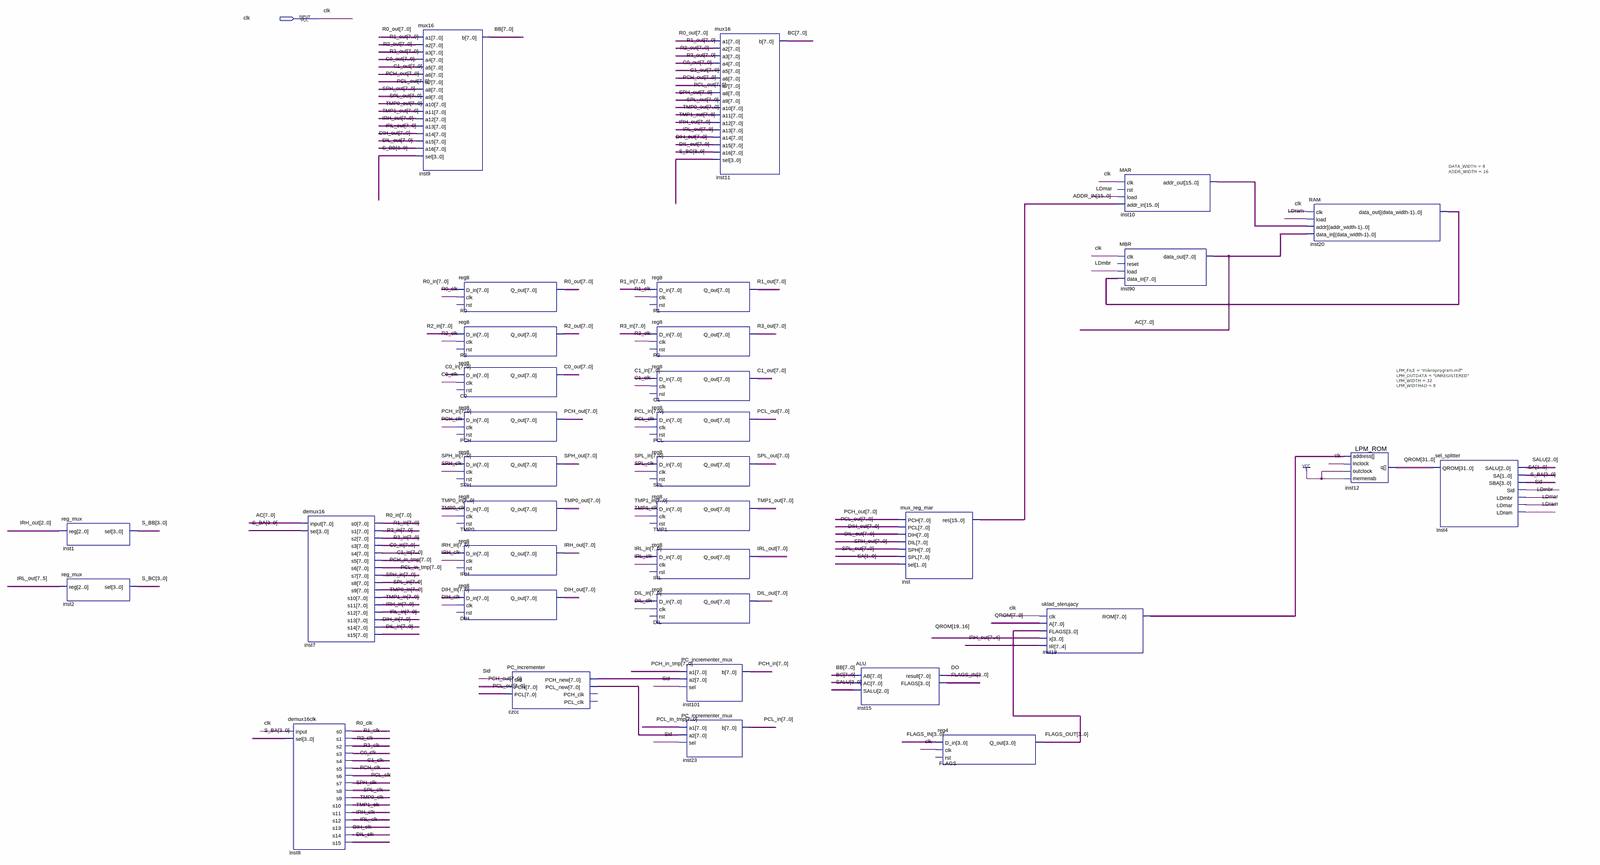
[diagram p0: schematic sheet, whole]
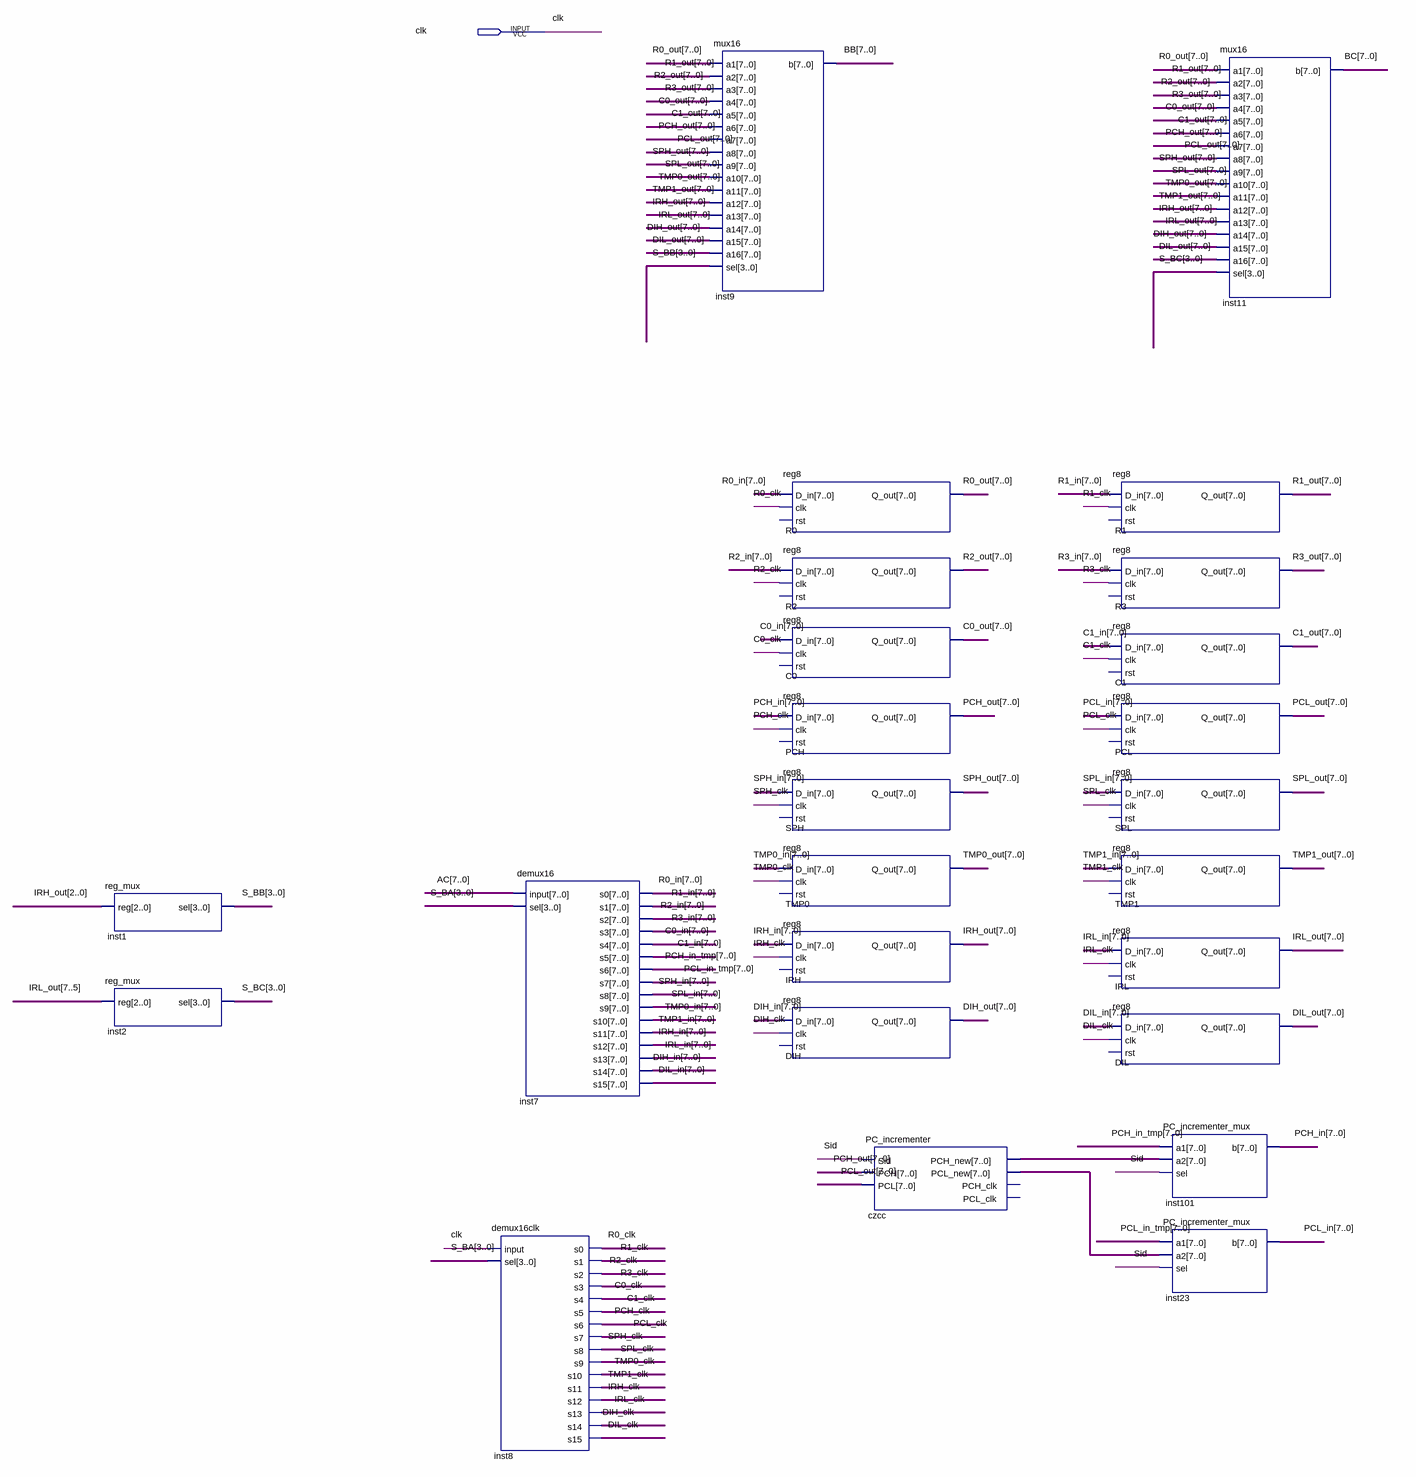
[diagram p1: schematic sheet, left part]
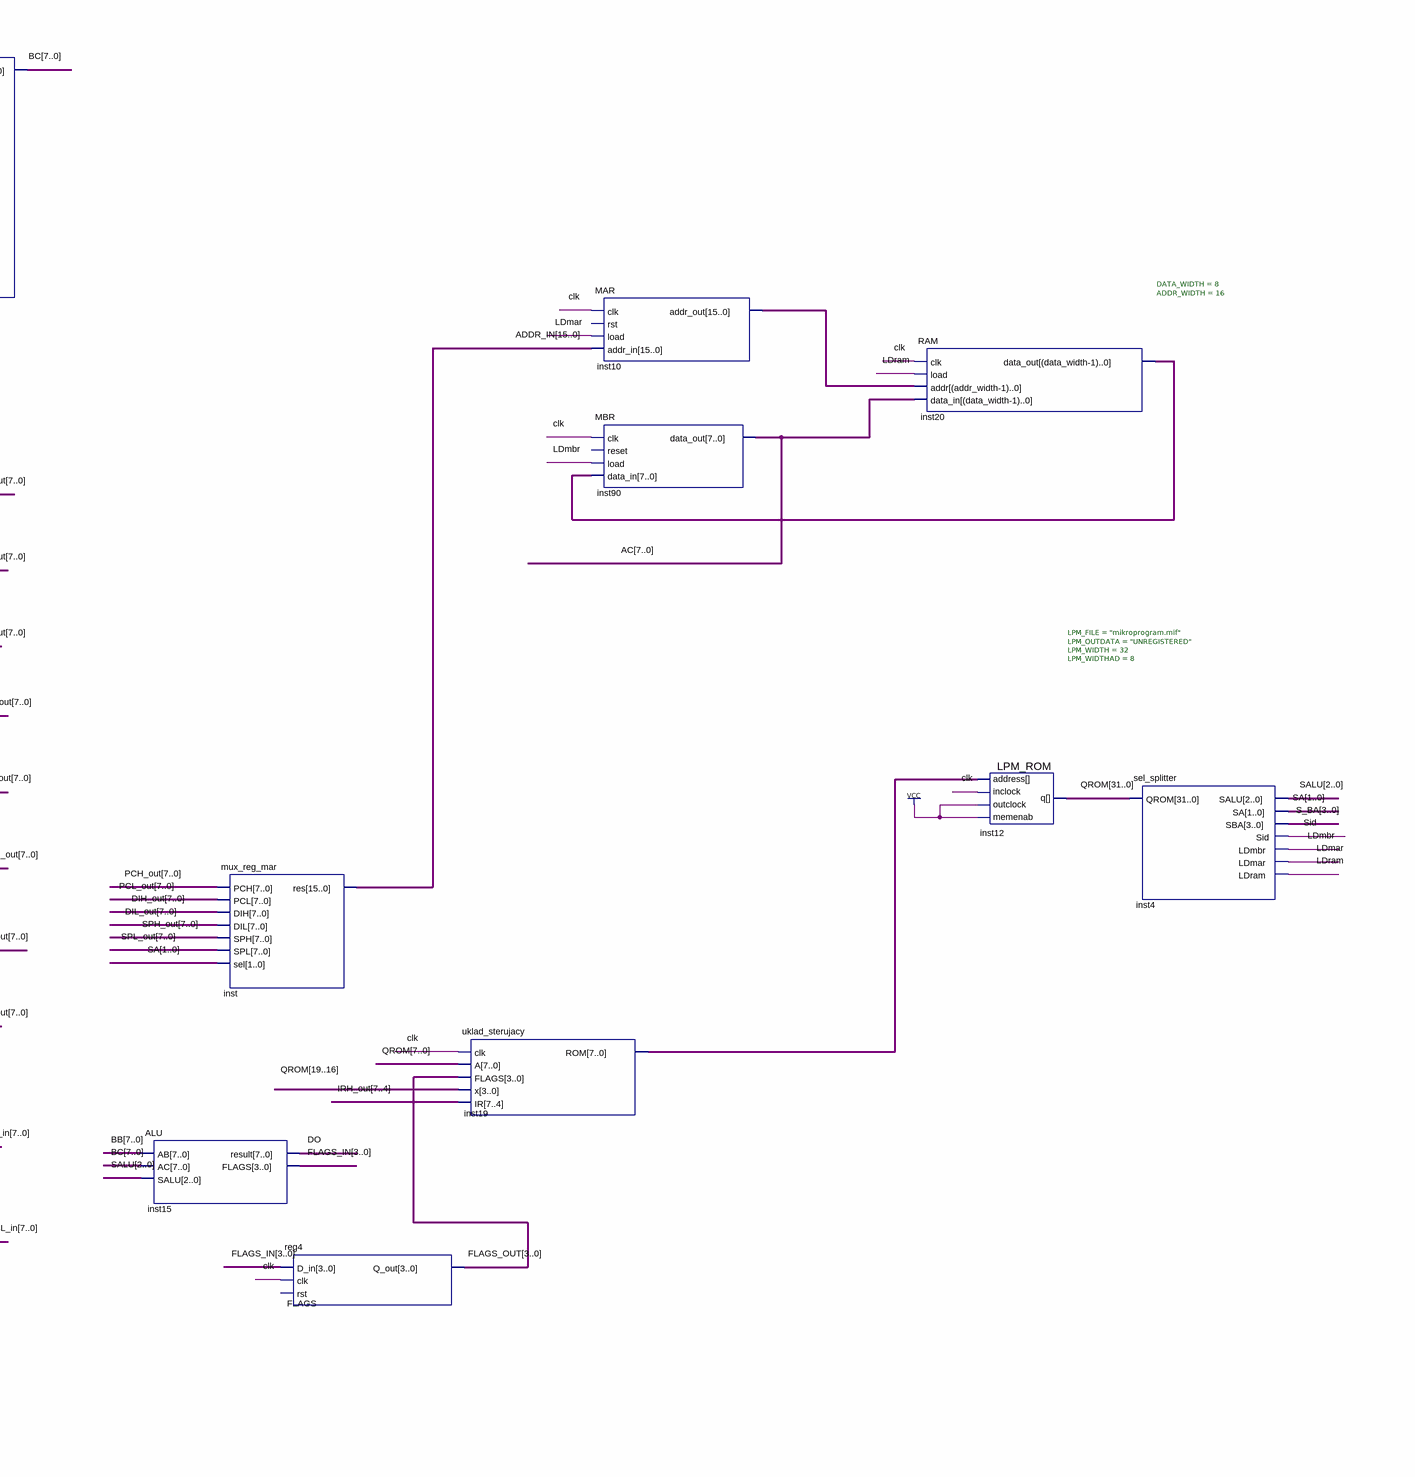
[diagram p2: schematic sheet, right part]
// Quartus schematic processor.bdf as structural Verilog: 34 symbols, 1 pins
module processor (
  input  clk
);

  wire C0_clk, C1_clk, DIH_clk, DIL_clk, DO, IRH_clk, IRL_clk, LDmar, LDmbr, LDram, PCH_clk, PCL_clk, R0_clk,
       R1_clk, R2_clk, R3_clk, Sid, SPH_clk, SPL_clk, TMP0_clk, TMP1_clk;
  wire [1:0] SA;
  wire [2:0] SALU;
  wire [3:0] FLAGS_IN, FLAGS_OUT, S_BA, S_BB, S_BC;
  wire [7:0] AC, BB, BC, C0_in, C0_out, C1_in, C1_out, czcc_pch_new, czcc_pcl_new, DIH_in, DIH_out, DIL_in,
       DIL_out, inst19_rom, inst20_data_out, IRH_in, IRH_out, IRL_in, IRL_out, PCH_in, PCH_in_tmp, PCH_out,
       PCL_in, PCL_in_tmp, PCL_out, R0_in, R0_out, R1_in, R1_out, R2_in, R2_out, R3_in, R3_out, SPH_in,
       SPH_out, SPL_in, SPL_out, TMP0_in, TMP0_out, TMP1_in, TMP1_out;
  wire [15:0] ADDR_IN, inst10_addr_out;
  wire [31:0] QROM;

  reg_mux inst1 (.\reg (IRH_out[2:0]), .sel(S_BB));
  reg_mux inst2 (.\reg (IRL_out[7:5]), .sel(S_BC));
  demux16 inst7 (
    .\input (AC), .sel(S_BA), .s0(R0_in), .s1(R1_in), .s2(R2_in), .s3(R3_in), .s4(C0_in), .s5(C1_in),
    .s6(PCH_in_tmp), .s7(PCL_in_tmp), .s8(SPH_in), .s9(SPL_in), .s10(TMP0_in), .s11(TMP1_in), .s12(IRH_in),
    .s13(IRL_in), .s14(DIH_in), .s15(DIL_in));
  demux16clk inst8 (
    .\input (clk), .sel(S_BA), .s0(R0_clk), .s1(R1_clk), .s2(R2_clk), .s3(R3_clk), .s4(C0_clk), .s5(C1_clk),
    .s6(PCH_clk), .s7(PCL_clk), .s8(SPH_clk), .s9(SPL_clk), .s10(TMP0_clk), .s11(TMP1_clk), .s12(IRH_clk),
    .s13(IRL_clk), .s14(DIH_clk), .s15(DIL_clk));
  mux16 inst9 (
    .a1(R0_out), .a2(R1_out), .a3(R2_out), .a4(R3_out), .a5(C0_out), .a6(C1_out), .a7(PCH_out), .a8(PCL_out),
    .a9(SPH_out), .a10(SPL_out), .a11(TMP0_out), .a12(TMP1_out), .a13(IRH_out), .a14(IRL_out), .a15(DIH_out),
    .a16(DIL_out), .sel(S_BB), .b(BB));
  reg8 R0 (.D_in(R0_in), .clk(R0_clk), .Q_out(R0_out));  // open: rst
  reg8 R2 (.D_in(R2_in), .clk(R2_clk), .Q_out(R2_out));  // open: rst
  reg8 C0 (.D_in(C0_in), .clk(C0_clk), .Q_out(C0_out));  // open: rst
  reg8 PCH (.D_in(PCH_in), .clk(PCH_clk), .Q_out(PCH_out));  // open: rst
  reg8 SPH (.D_in(SPH_in), .clk(SPH_clk), .Q_out(SPH_out));  // open: rst
  reg8 TMP0 (.D_in(TMP0_in), .clk(TMP0_clk), .Q_out(TMP0_out));  // open: rst
  reg8 IRH (.D_in(IRH_in), .clk(IRH_clk), .Q_out(IRH_out));  // open: rst
  reg8 DIH (.D_in(DIH_in), .clk(DIH_clk), .Q_out(DIH_out));  // open: rst
  PC_incrementer czcc (
    .Sid(Sid), .PCH(PCH_out), .PCL(PCL_out), .PCH_new(czcc_pch_new), .PCL_new(czcc_pcl_new));  // open: PCH_clk, PCL_clk
  reg8 R1 (.D_in(R1_in), .clk(R1_clk), .Q_out(R1_out));  // open: rst
  reg8 R3 (.D_in(R3_in), .clk(R3_clk), .Q_out(R3_out));  // open: rst
  reg8 C1 (.D_in(C1_in), .clk(C1_clk), .Q_out(C1_out));  // open: rst
  reg8 PCL (.D_in(PCL_in), .clk(PCL_clk), .Q_out(PCL_out));  // open: rst
  reg8 SPL (.D_in(SPL_in), .clk(SPL_clk), .Q_out(SPL_out));  // open: rst
  reg8 TMP1 (.D_in(TMP1_in), .clk(TMP1_clk), .Q_out(TMP1_out));  // open: rst
  reg8 IRL (.D_in(IRL_in), .clk(IRL_clk), .Q_out(IRL_out));  // open: rst
  reg8 DIL (.D_in(DIL_in), .clk(DIL_clk), .Q_out(DIL_out));  // open: rst
  PC_incrementer_mux inst101 (.a1(PCH_in_tmp), .a2(czcc_pch_new), .sel(Sid), .b(PCH_in));
  PC_incrementer_mux inst23 (.a1(PCL_in_tmp), .a2(czcc_pcl_new), .sel(Sid), .b(PCL_in));
  mux16 inst11 (
    .a1(R0_out), .a2(R1_out), .a3(R2_out), .a4(R3_out), .a5(C0_out), .a6(C1_out), .a7(PCH_out), .a8(PCL_out),
    .a9(SPH_out), .a10(SPL_out), .a11(TMP0_out), .a12(TMP1_out), .a13(IRH_out), .a14(IRL_out), .a15(DIH_out),
    .a16(DIL_out), .sel(S_BC), .b(BC));
  ALU inst15 (.AB(BB), .AC(BC), .SALU(SALU), .result(DO), .FLAGS(FLAGS_IN));
  mux_reg_mar inst (
    .PCH(PCH_out), .PCL(PCL_out), .DIH(DIH_out), .DIL(DIL_out), .SPH(SPH_out), .SPL(SPL_out), .sel(SA),
    .res(ADDR_IN));
  reg4 FLAGS (.D_in(FLAGS_IN), .clk(clk), .Q_out(FLAGS_OUT));  // open: rst
  uklad_sterujacy inst19 (
    .clk(clk), .A(QROM[7:0]), .FLAGS(FLAGS_OUT), .x(QROM[19:16]), .IR(IRH_out[7:4]), .ROM(inst19_rom));
  MAR inst10 (.clk(clk), .load(LDmar), .addr_in(ADDR_IN), .addr_out(inst10_addr_out));  // open: rst
  MBR inst90 (.clk(clk), .load(LDmbr), .data_in(inst20_data_out), .data_out(AC));  // open: reset
  RAM #(.DATA_WIDTH(8), .ADDR_WIDTH(16)) inst20 (
    .clk(clk), .load(LDram), .addr(inst10_addr_out), .data_in(AC), .data_out(inst20_data_out));
  LPM_ROM #(.LPM_FILE("mikroprogram.mif"), .LPM_OUTDATA("UNREGISTERED"), .LPM_WIDTH(32), .LPM_WIDTHAD(8)) inst12 (
    .address(inst19_rom), .inclock(clk), .outclock(1'b1), .memenab(1'b1), .q(QROM));
  sel_splitter inst4 (
    .QROM(QROM), .SALU(SALU), .SA(SA), .SBA(S_BA), .Sid(Sid), .LDmbr(LDmbr), .LDmar(LDmar), .LDram(LDram));
endmodule
